# EAGLE design vibro4 copy (EAGLE 5.04)
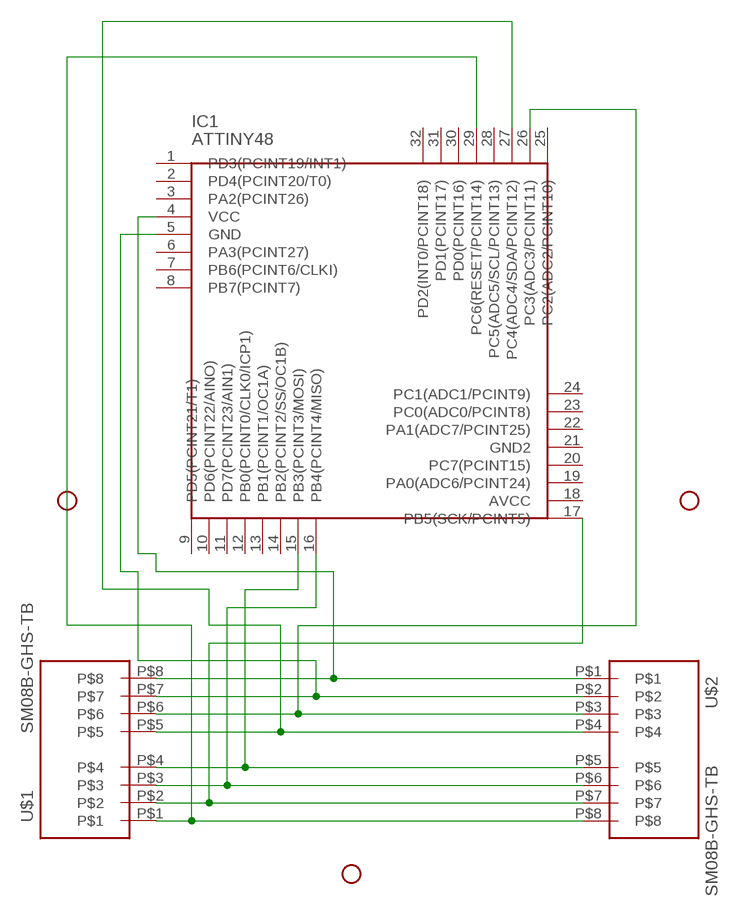
[diagram p0: schematic, sheet 1]

## Parts
IC1  ATTINY48  [TQFP32-08]
U$1  SM08B-GHS-TB  [SM08B-GHS-TB]
U$2  SM08B-GHS-TB  [SM08B-GHS-TB]
U$3  STAND-OFF  [STAND-OFF]
U$4  STAND-OFF  [STAND-OFF]
U$5  STAND-OFF  [STAND-OFF]

## Nets
N$1: IC1.4(VCC) U$1.P$8 U$2.P$1
N$2: IC1.5(GND) U$1.P$7 U$2.P$2
N$3: IC1.26(PC3(ADC3/PCINT11)) U$1.P$6 U$2.P$3
N$4: IC1.27(PC4(ADC4/SDA/PCINT12)) U$1.P$5 U$2.P$4
N$5: IC1.15(PB3(PCINT3/MOSI)) U$1.P$4 U$2.P$5
N$6: IC1.16(PB4(PCINT4/MISO)) U$1.P$3 U$2.P$6
N$7: IC1.17(PB5(SCK/PCINT5)) U$1.P$2 U$2.P$7
N$8: IC1.29(PC6(RESET/PCINT14)) U$1.P$1 U$2.P$8
Unconnected: IC1.1(PD3(PCINT19/INT1)) IC1.2(PD4(PCINT20/T0)) IC1.3(PA2(PCINT26)) IC1.6(PA3(PCINT27)) IC1.7(PB6(PCINT6/CLKI)) IC1.8(PB7(PCINT7)) IC1.9(PD5(PCINT21/T1)) IC1.10(PD6(PCINT22/AINO)) IC1.11(PD7(PCINT23/AIN1)) IC1.12(PB0(PCINT0/CLK0/ICP1)) IC1.13(PB1(PCINT1/OC1A)) IC1.14(PB2(PCINT2/SS/OC1B)) IC1.18(AVCC) IC1.19(PA0(ADC6/PCINT24)) IC1.20(PC7(PCINT15)) IC1.21(GND2) IC1.22(PA1(ADC7/PCINT25)) IC1.23(PC0(ADC0/PCINT8)) IC1.24(PC1(ADC1/PCINT9)) IC1.25(PC2(ADC2/PCINT10)) IC1.28(PC5(ADC5/SCL/PCINT13)) IC1.30(PD0(PCINT16)) IC1.31(PD1(PCINT17)) IC1.32(PD2(INT0/PCINT18))

## Library data of the parts
IC1 = SparkFun:ATTINY48: ATTINY48 ATMEL
U$1 U$2 = con-jst-cubic:SM08B-GHS-TB: JST EGH SM08B-GHS-TB side entry 8 pin
U$3-U$5 = SparkFun:STAND-OFF: Stand Off This is the mechanical footprint for a #4 phillips button head screw. Use the keepout ring to avoid running the screw head into surrounding components. SKU : PRT-00447

## Board
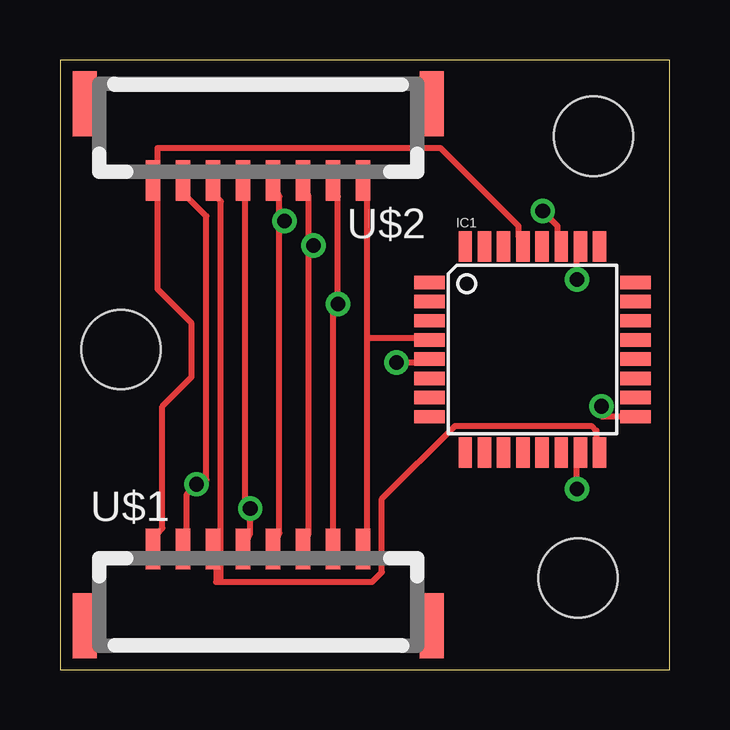
[diagram p1: board, top side]
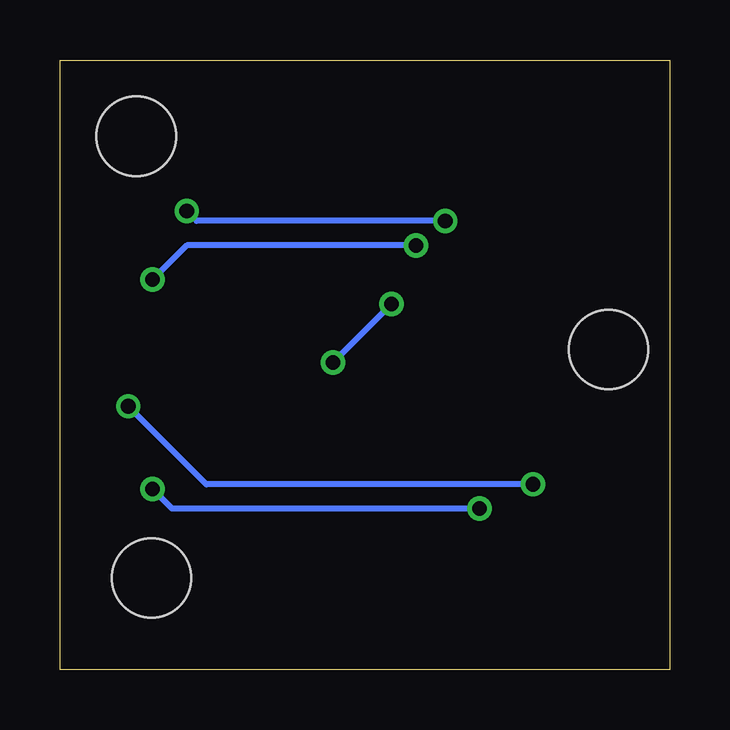
[diagram p2: board, bottom side, seen from below]

Size 25.4 x 25.4 mm. Coordinates in mm from the lower left corner, seen from the top.
Outline: 0,0 25.4,0 25.4,25.4 0,25.4 0,0
Copper layers (1*16): Top 0.035mm / dielectric 1.5mm / Bottom 0.035mm
Design rules "default": minimum track width 10mil, minimum drill 24mil, track to track 8mil, track to pad 8mil, pad to pad 8mil, via to via 8mil, smd to smd 8mil, copper to edge 40mil, drill to drill 8mil, minimum pad ring 10mil, minimum via ring 8mil, stop-mask expansion 4mil, vias tented up to drill 0mil, thermal gap 10mil

### Footprints (pad centres in the part's own frame; a part is rotated, then mirrored left to right if it is on the bottom)
TQFP32-08 = smd 1.27 x 0.559: 1 -4.293,2.8; 2 -4.293,2; 3 -4.293,1.2; 4 -4.293,0.4; 5 -4.293,-0.4; 6 -4.293,-1.2; 7 -4.293,-2; 8 -4.293,-2.8; 17 4.293,-2.8; 18 4.293,-2; 19 4.293,-1.2; 20 4.293,-0.4; 21 4.293,0.4; 22 4.293,1.2; 23 4.293,2; 24 4.293,2.8 | smd 0.559 x 1.27: 9 -2.8,-4.293; 10 -2,-4.293; 11 -1.2,-4.293; 12 -0.4,-4.293; 13 0.4,-4.293; 14 1.2,-4.293; 15 2,-4.293; 16 2.8,-4.293; 25 2.8,4.293; 26 2,4.293; 27 1.2,4.293; 28 0.4,4.293; 29 -0.4,4.293; 30 -1.2,4.293; 31 -2,4.293; 32 -2.8,4.293
SM08B-GHS-TB = smd 0.6 x 1.7: P$1 -4.375,1.85; P$2 -3.125,1.85; P$3 -1.875,1.85; P$4 -0.625,1.85; P$5 0.625,1.85; P$6 1.875,1.85; P$7 3.125,1.85; P$8 4.375,1.85 | smd 1 x 2.7: P$9 7.225,-1.35; P$10 -7.225,-1.35
STAND-OFF = hole 3.302: 0,0

### Placement (x,y rotation side)
IC1  19.68,13.34 0 top
U$1  8.26,3.17 0 top
U$2  8.26,22.23 180 top
U$3  22.23,22.23 0 top
U$4  2.54,13.34 0 top
U$5  21.59,3.81 0 top

### Tracks (layer width: path | path; a pad name or v marks a point on that pad's centre or on a via)
N$1
  Top 0.254: 12.8,13.82 14.83,13.82 IC1.4 | 12.8,13.82 12.8,19.71 U$2.P$1 | 12.8,13.82 12.8,5.69 U$1.P$8
N$2  (via drill 0.61)
  Top 0.254: v14.02,12.8 14.83,12.8 IC1.5 | U$2.P$2 11.58,19.71 v11.58,15.24 11.38,14.83 11.38,5.69 U$1.P$7
  Bottom 0.254: v11.58,15.24 v14.02,12.8
N$3  (via drill 0.61)
  Top 0.254: v21.54,16.26 21.54,17.07 IC1.26 | U$2.P$3 10.36,19.71 10.36,17.88 v10.57,17.68 10.36,17.27 10.36,5.69 U$1.P$6
  Bottom 0.254: v21.54,16.26 20.12,17.68 v10.57,17.68
N$4  (via drill 0.61)
  Top 0.254: v20.12,19.1 20.73,18.49 20.73,18.09 IC1.27 | U$2.P$4 9.14,19.71 9.14,18.9 v9.35,18.69 9.14,18.29 9.14,5.69 U$1.P$5
  Bottom 0.254: v20.12,19.1 19.71,18.69 v9.35,18.69
N$5  (via drill 0.61)
  Top 0.254: v21.54,7.52 21.54,8.53 IC1.15 | U$1.P$4 7.92,5.69 v7.92,6.71 7.72,7.11 7.72,19.71 U$2.P$5
  Bottom 0.254: v21.54,7.52 20.73,6.71 v7.92,6.71
N$6
  Top 0.254: 6.71,3.66 6.5,3.66 6.5,4.27 U$1.P$3 | 6.71,3.66 13.01,3.66 13.41,4.06 13.41,7.11 16.46,10.16 22.15,10.16 22.35,9.96 22.35,9.55 IC1.16 | 6.71,3.66 6.71,19.51 6.5,19.71 U$2.P$6
N$7  (via drill 0.61)
  Top 0.254: v22.55,10.97 22.55,10.57 23.37,10.57 IC1.17 | U$1.P$2 5.28,5.69 5.28,7.32 v5.69,7.72 6.1,7.92 6.1,18.9 5.28,19.71 U$2.P$7
  Bottom 0.254: v22.55,10.97 19.3,7.72 v5.69,7.72
N$8
  Top 0.254: IC1.29 19.1,18.09 19.1,18.49 15.85,21.74 4.06,21.74 4.06,21.13 U$2.P$8 4.06,19.71 4.06,15.85 5.49,14.43 5.49,12.19 4.27,10.97 4.27,5.89 4.06,5.69 U$1.P$1